# EasyEDA Pro project ProProject_基于CW32单片机的无刷电机控制器（旋转变压器位置反馈）_2024-06-02.epro, board PCB7
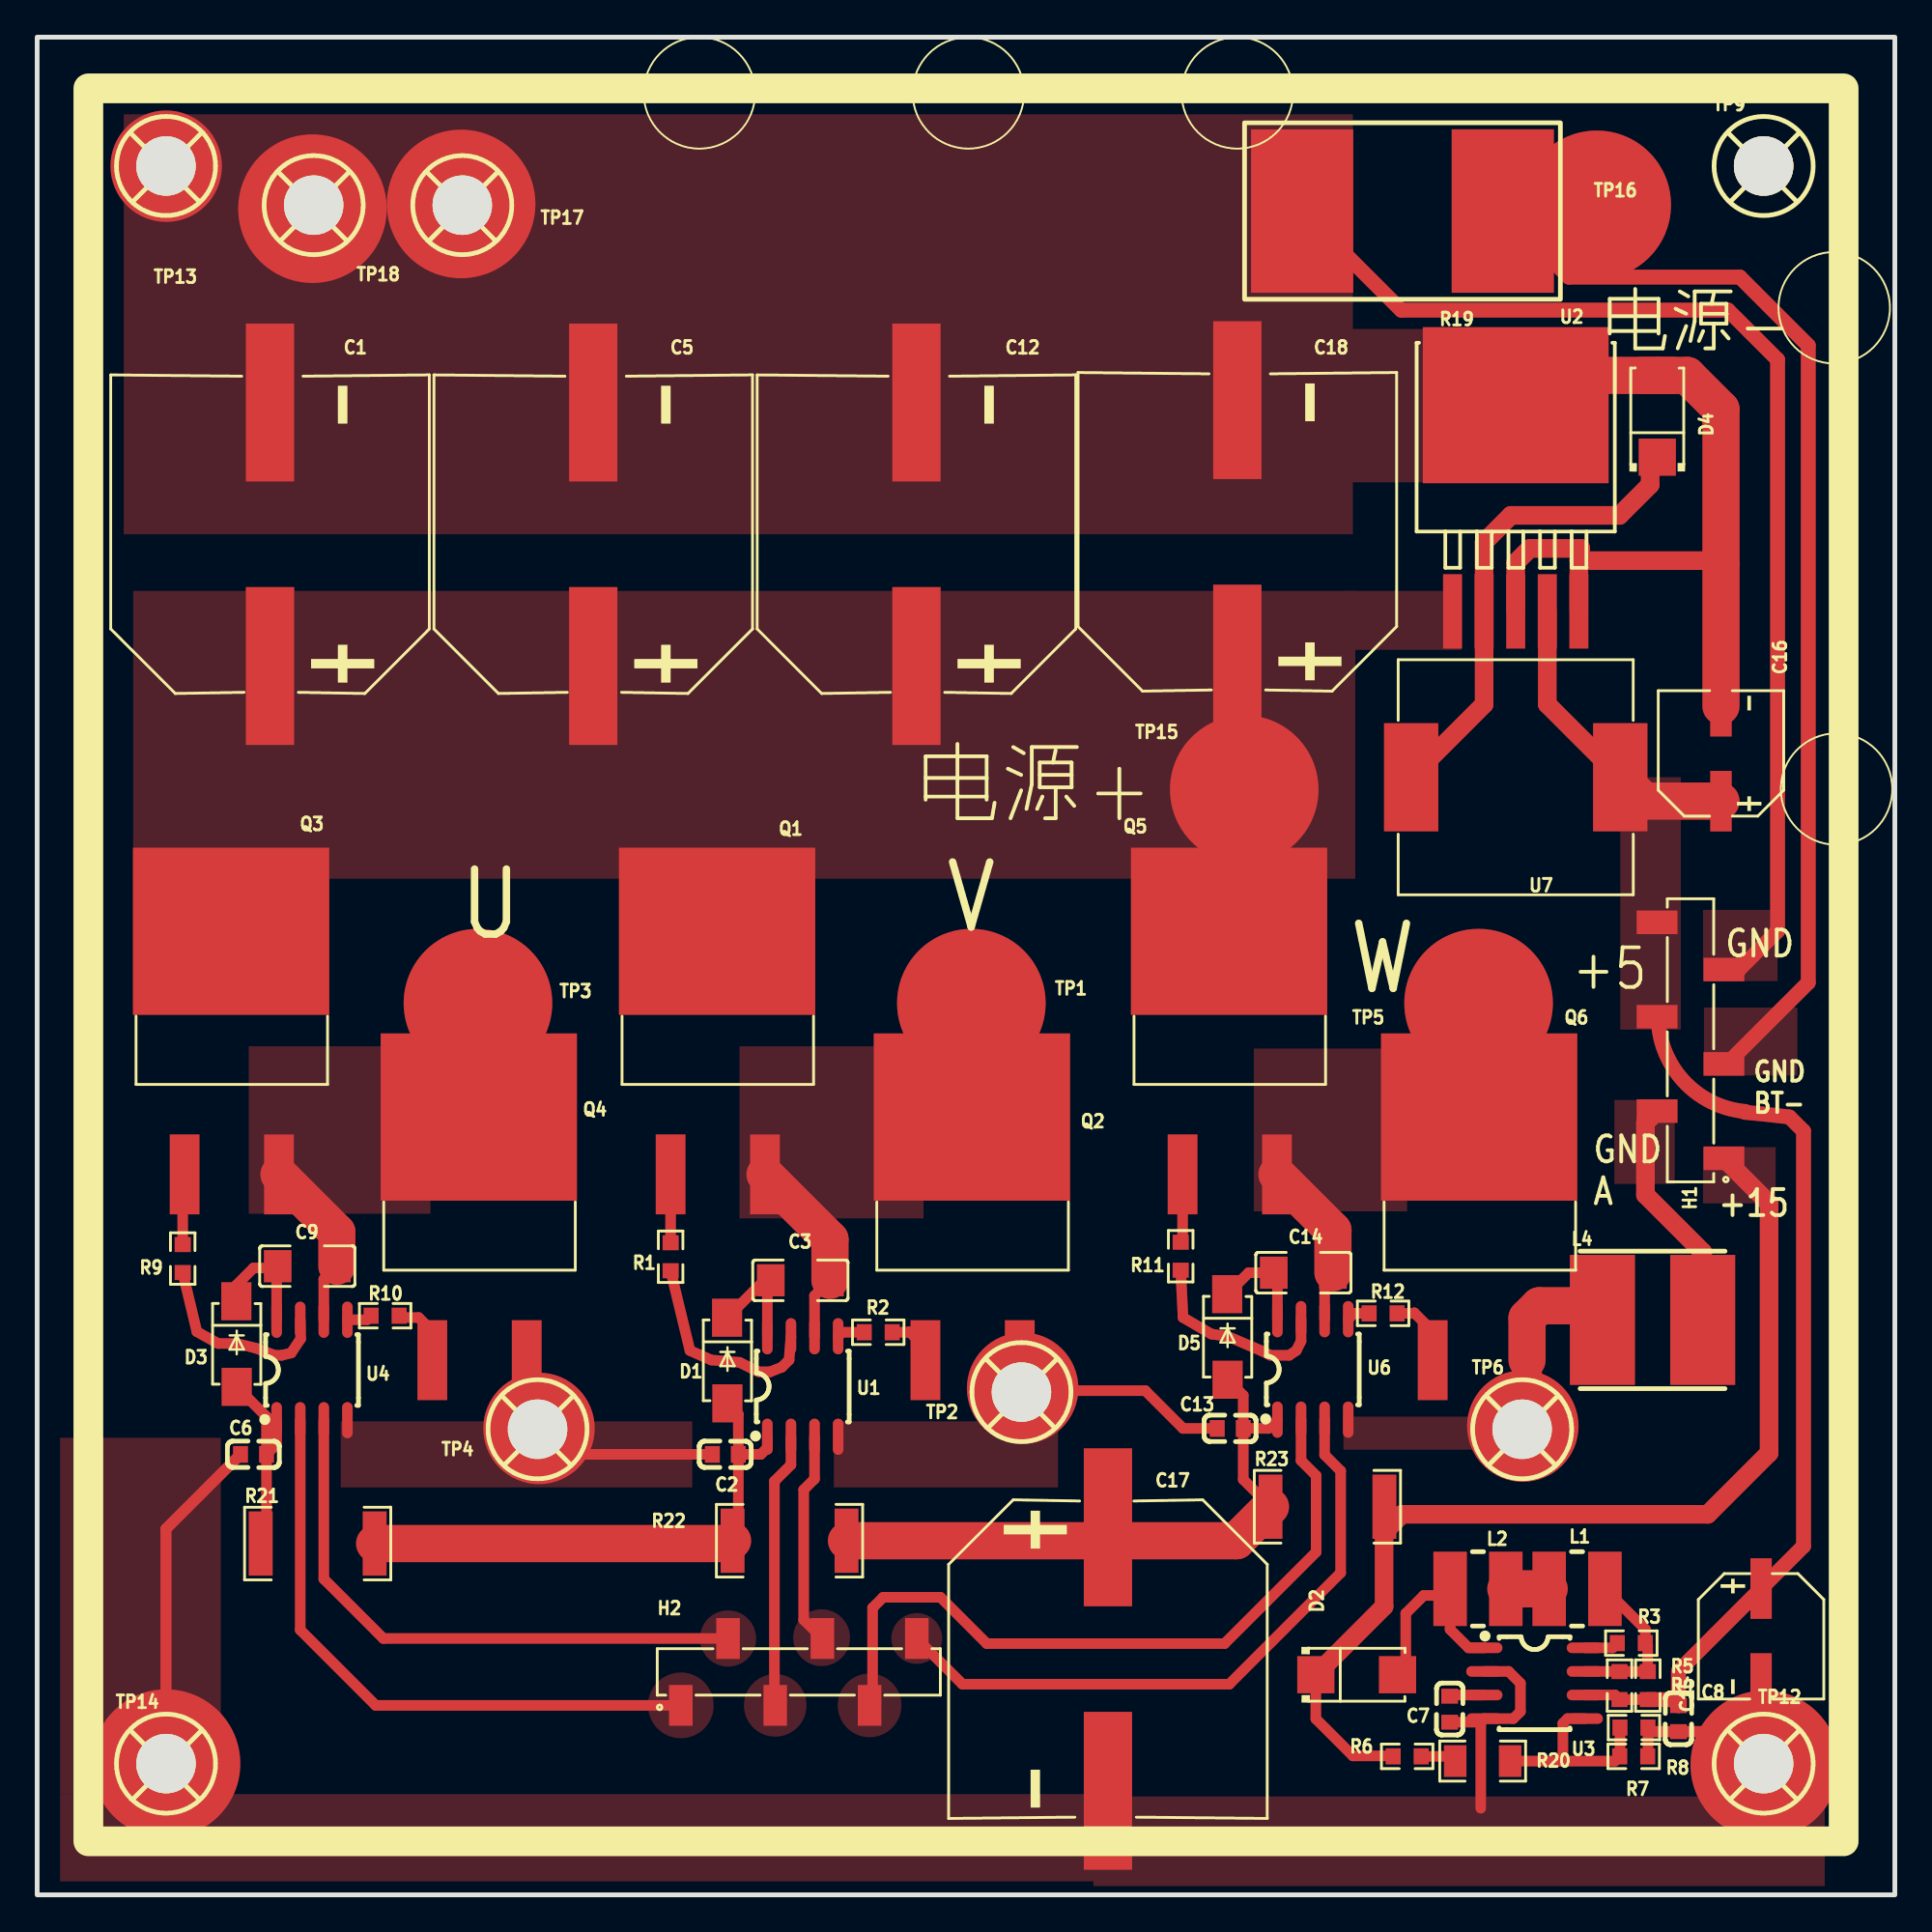
[diagram p6: board, top side]
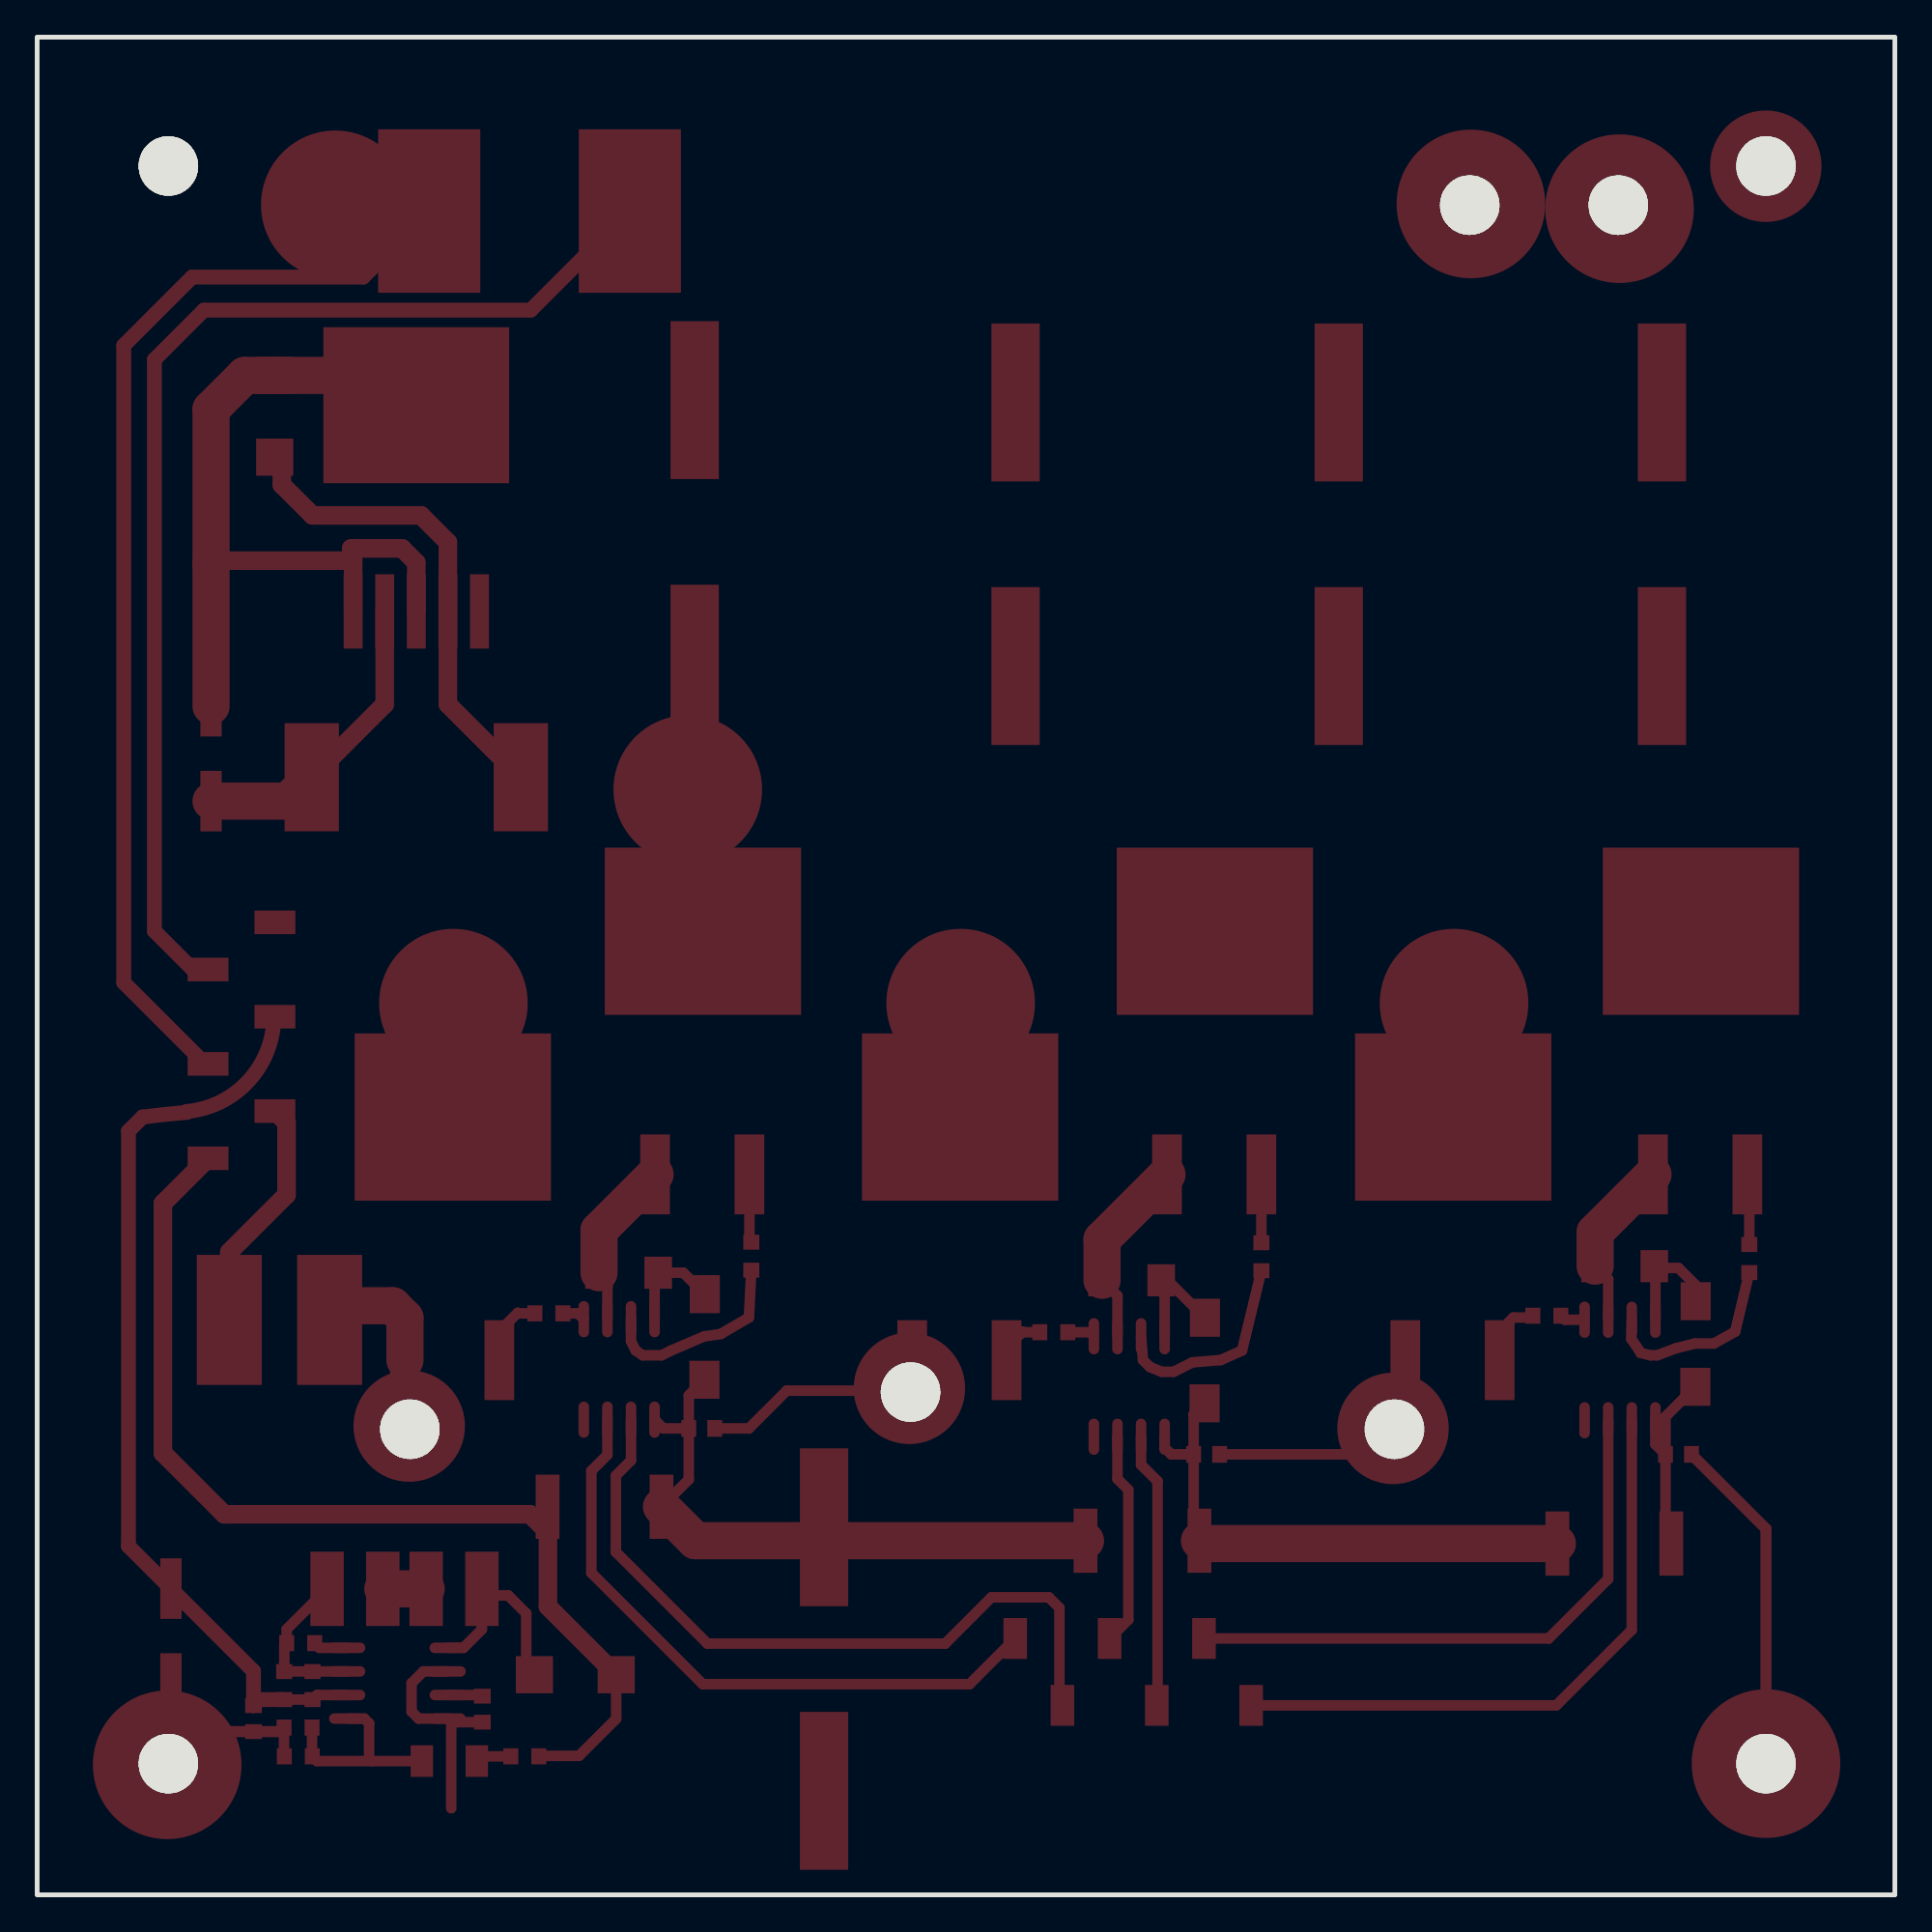
[diagram p7: board, bottom side, seen from below]

Outline 100 x 100 mm; copper layers: Top Layer, Bottom Layer. Coordinates in mm from the lower left corner of the outline.
Outline path: rectangle 0,0 100,100
Stack: Top Layer 0.035mm / Dielectric1 1.51mm FR4 er 4.5 / Bottom Layer 0.035mm

## Design rules (mm)
template: JLCPCB Capability(Two Layers Board)
spacing copperThickness1oz (default): track to track 0.102, other pairs 0.152 to 0.3
spacing copperThickness2oz: track to track 0.203, other pairs 0.152 to 0.3
track width copperThickness1oz (default): min 0.127, default 0.254, max 2.54
track width copperThickness2oz: min 0.203, default 0.254, max 2.54
differential pair differentialPair (default): width min 0.127, default 0.254, max 2.54; gap min 0.152, default 0.152
via viaSize (default): diameter min 0.5, default 0.61, max 10; hole min 0.3, default 0.305, max 6.3

## Placement (name value [footprint] x y rotation side)
C1  2200uF  [CAP-SMD_BD16.0-L17.0-W17.0-LS18.0-FD]  12.53 73.24 90 top
C2  100nF  [C0603]  37.05 23.71 0 top
C3  10uF  [C1206]  41.08 33.08 180 top
C5  2200uF  [CAP-SMD_BD16.0-L17.0-W17.0-LS18.0-FD]  29.93 73.24 90 top
C6  100nF  [C0603]  11.65 23.71 0 top
C7  1nF  [C0603]  76.03 10 270 top
C8  100nF  [C0603]  88.35 9.49 90 top
C9  10uF  [C1206]  14.54 33.84 180 top
C12  2200uF  [CAP-SMD_BD16.0-L17.0-W17.0-LS18.0-FD]  47.33 73.24 90 top
C13  100nF  [C0603]  64.22 25.11 0 top
C14  10uF  [C1206]  68.16 33.49 180 top
C15  220uF  [CAP-SMD_BD6.3-L6.6-W6.6-LS7.2-R-RD]  92.8 13.93 90 top
C16  220uF  [CAP-SMD_BD6.3-L6.6-W6.6-LS7.2-R-RD]  90.64 61.43 270 top
C17  2200uF  [CAP-SMD_BD16.0-L17.0-W17.0-LS18.0-FD]  57.64 12.69 270 top
C18  2200uF  [CAP-SMD_BD16.0-L17.0-W17.0-LS18.0-FD]  64.6 73.37 90 top
D1  RS1M  [SMA_L4.3-W2.6-LS5.0-FD]  37.15 28.76 90 top
D2  SS34  [SMA_L4.3-W2.6-LS5.2-RD]  71.03 11.85 0 top
D3  RS1M  [SMA_L4.3-W2.6-LS5.0-FD]  10.73 29.65 90 top
D4  SS34  [SMA_L4.3-W2.6-LS5.2-RD]  87.21 79.59 90 top
D5  RS1M  [SMA_L4.3-W2.6-LS5.0-FD]  64.07 30.03 90 top
H1  X6511WVS-06H-C60D48R2  [HDR-SMD_6P-P2.54-V-M-LS4.8_R2]  89 46 90 top
H2  X6511WVS-06H-C60D48R2  [HDR-SMD_6P-P2.54-V-M-LS4.8_R2]  41 12 0 top
L1  47uH  [IND-SMD_L4.5-W4.0_SLF0403]  82.89 16.47 180 top
L2  47uH  [IND-SMD_L4.5-W4.0_SLF0403]  77.56 16.47 180 top
L4  2.2mH  [IND-SMD_L7.8-W7.0-A]  86.96 30.95 0 top
NOREF  -  [Pad_e577]  6.94 7.06 0 top
NOREF#2  -  [Pad_e290]  14.82 90.77 0 top
NOREF#3  -  [Pad_e293]  79.97 25.24 0 top
NOREF#4  -  [Pad_e288]  6.95 93.05 0 top
NOREF#5  -  [Pad_e289]  22.82 91.02 0 top
NOREF#6  -  [Pad_e291]  27.01 25.11 0 top
NOREF#7  -  [Pad_e337]  93 7 0 top
NOREF#8  -  [Pad_e292]  53.05 27.27 0 top
Q1  IRF2804STRLPBF  [D2PAK_L10.0-W9.0-P2.54-LS15.0-BR]  36.64 45 270 top
Q2  IRF2804STRLPBF  [D2PAK_L10.0-W9.0-P2.54-LS15.0-BR]  50.36 35 270 top
Q3  IRF2804STRLPBF  [D2PAK_L10.0-W9.0-P2.54-LS15.0-BR]  10.48 45 270 top
Q4  IRF2804STRLPBF  [D2PAK_L10.0-W9.0-P2.54-LS15.0-BR]  23.81 35 270 top
Q5  IRF2804STRLPBF  [D2PAK_L10.0-W9.0-P2.54-LS15.0-BR]  64.2 45 270 top
Q6  IRF2804STRLPBF  [D2PAK_L10.0-W9.0-P2.54-LS15.0-BR]  77.66 35 270 top
R1  10Ω  [R0603]  34.1 34.35 90 top
R2  10Ω  [R0603]  45.28 30.29 0 top
R3  100Ω  [R0603]  85.81 13.55 0 top
R4  1Ω  [R0603]  85.18 11.26 90 top
R5  1Ω  [R0603]  86.7 11.26 90 top
R6  10kΩ  [R0603]  73.75 7.46 180 top
R7  10kΩ  [R0603]  85.94 7.46 180 top
R8  1kΩ  [R0603]  85.96 9 180 top
R9  10Ω  [R0603]  7.84 34.25 90 top
R10  10Ω  [R0603]  18.73 31.17 0 top
R11  10Ω  [R0603]  61.56 34.38 90 top
R12  10Ω  [R0603]  72.45 31.3 0 top
R19  3mΩ  [R5930]  73.5 90.64 180 top
R20  0Ω  [R1206]  77.81 7.2 180 top
R21  0Ω  [R2512]  15.1 18.91 0 top
R22  0Ω  [R2512]  40.5 19.06 0 top
R23  0Ω  [R2512]  69.46 20.89 0 top
TP1  -  [test-point-0.5mm]  50.29 48 0 top
TP2  -  [M3螺丝]  53.05 27 0 top
TP3  -  [test-point-0.5mm]  23.73 48 0 top
TP4  -  [M3螺丝]  27 25 0 top
TP5  -  [test-point-0.5mm]  77.59 48 0 top
TP6  -  [M3螺丝]  80 25 0 top
TP9  -  [M3螺丝]  93 93 0 top
TP12  -  [M3螺丝]  93 7 0 top
TP13  -  [M3螺丝]  7 93 0 top
TP14  -  [M3螺丝]  7 7 0 top
TP15  -  [test-point-0.5mm]  64.98 59.5 0 top
TP16  -  [test-point-0.5mm]  83.95 90.97 0 top
TP17  -  [M3螺丝]  22.95 90.89 0 top
TP18  -  [M3螺丝]  14.95 90.89 0 top
U1  EG2131  [SOIC-8_L5.0-W4.0-P1.27-LS6.0-BL]  41.21 27.36 0 top
U2  LM2596S-5.0-MS  [TO-263-5_L10.0-W8.4-P1.70-LS15.3-BR]  79.59 74.64 270 top
U3  MC34063  [SOIC-8_L5.0-W4.0-P1.27-LS6.0-BL]  80.61 11.39 270 top
U4  EG2131  [SOIC-8_L5.0-W4.0-P1.27-LS6.0-BL]  14.8 28.25 0 top
U6  EG2131  [SOIC-8_L5.0-W4.0-P1.27-LS6.0-BL]  68.67 28.28 0 top
U7  100uH  [IND-SMD_L13.5-W12.8]  79.59 60.16 180 top

## Footprints (pads in the part's own frame, mm; a bottom-side part is the same pattern mirrored in y, then rotated)
C0603
  rect 0.8x0.9 smd: 1(-0.7,0) 2(0.7,0)
C1206
  rect 1.485x1.728 smd: 1(-1.593,0) 2(1.593,0)
CAP-SMD_BD6.3-L6.6-W6.6-LS7.2-R-RD
  rect 3.26x1.15 smd: 1(2.555,0) 2(-2.555,0)
CAP-SMD_BD16.0-L17.0-W17.0-LS18.0-FD
  rect 8.5x2.6 smd: 1(-7.093,0) 2(7.093,0)
D2PAK_L10.0-W9.0-P2.54-LS15.0-BR
  rect 4.3x1.6 smd: 1(6.218,-2.54) 3(6.218,2.54)
  rect 9x10.566 smd: 2(-6.87,-0.038)
HDR-SMD_6P-P2.54-V-M-LS4.8_R2
  rect 1.27x2.2 smd: 1(-6.35,-1.8) 2(-3.81,1.8) 3(-1.27,-1.8) 4(1.27,1.8) 5(3.81,-1.8) 6(6.35,1.8)
IND-SMD_L4.5-W4.0_SLF0403
  rect 1.8x4 smd: 1(-1.5,0) 2(1.5,0)
IND-SMD_L7.8-W7.0-A
  rect 3.5x7 smd: 1(-2.7,0) 2(2.7,0)
IND-SMD_L13.5-W12.8
  rect 2.924x5.82 smd: 1(5.628,0) 2(-5.628,0)
M3螺丝
  round 3.2 hole 3.2: 1(-0.064,0.064)
Pad_e288
  round 6 smd: TP1(0,0)
Pad_e289
  round 8 smd: TP2(0,0)
Pad_e290
  round 8 smd: TP3(0,0)
Pad_e291
  round 6 smd: TP4(0,0)
Pad_e292
  round 6 smd: TP5(0,0)
Pad_e293
  round 6 smd: TP6(0,0)
Pad_e337
  round 8 smd: TP6(0,0)
Pad_e577
  round 8 smd: TP4(0,0)
R0603
  rect 0.806x0.864 smd: 1(-0.753,0) 2(0.753,0)
R1206
  rect 1.208x1.701 smd: 1(-1.479,0) 2(1.479,0)
R2512
  rect 1.282x3.456 smd: 1(-3.067,0) 2(3.067,0)
R5930
  rect 5.5x8.8 smd: 1(-5.4,0) 2(5.4,0)
SMA_L4.3-W2.6-LS5.0-FD
  rect 2.046x1.62 smd: 1(-2.304,-0.009) 2(2.304,0.009)
SMA_L4.3-W2.6-LS5.2-RD
  rect 2x2 smd: 1(-2.2,0) 2(2.2,0)
SOIC-8_L5.0-W4.0-P1.27-LS6.0-BL
  oval 0.569x1.95 smd: 1(-1.905,-2.705) 2(-0.635,-2.705) 3(0.635,-2.705) 4(1.905,-2.705) 5(1.905,2.705) 6(0.635,2.705) 7(-0.635,2.705) 8(-1.905,2.705)
test-point-0.5mm
  round 8 smd: 1(0,0)
TO-263-5_L10.0-W8.4-P1.70-LS15.3-BR
  rect 4x1.02 smd: 1(5.55,-3.4) 2(5.55,-1.7) 3(5.55,0) 4(5.55,1.7) 5(5.55,3.4)
  rect 8.4x10 smd: 6(-5.55,0)

## Nets
As in the schematic, except:
GND: C1.2 C2.1 C5.2 C6.1 C7.2 C8.1 C12.2 C13.1 C15.2 C16.2 C17.2 C18.2 D4.2 H1.5 L4.1 NOREF.TP4 NOREF#2.TP3 NOREF#3.TP6 NOREF#4.TP1 NOREF#5.TP2 NOREF#6.TP4 NOREF#7.TP6 NOREF#8.TP5 Q2.3 Q4.3 Q6.3 R7.1 R8.1 R19.2 TP2.1 TP4.1 TP6.1 TP9.1 TP12.1 TP13.1 TP14.1 TP17.1 TP18.1 U1.4 U2.3 U2.5 U2.6 U3.2 U3.4 U4.4 U6.4

## Routing (per net, layer and track width the routed paths; a pad name or vN(x,y) marks a point on that pad's centre or on a via; arc(x,y) is an arc through that point)
+5V: length 66.7
  Top Layer w0.568: R5.1 R4.1 84.93,10.76 U3.6
  Top Layer w0.8: R5.1 88.03,10.51 88.35,10.19 88.35,12.04 C15.1 95.09,18.77 95.09,41.11 94.32,41.87 arc(93.12,42.01) 91.91,42.13 ; 87.26,47.31 arc(88.61,43.82) 91.97,42.17
  Top Layer w1: U7.2 81.29,64.09 U2.4
  Top Layer w2: U7.2 86.5,58.88 C16.1
+15V: length 55.9
  Top Layer w0.568: D2.1 68.83,9.48 70.83,7.48 72.97,7.48 R6.2
  Top Layer w1: D2.1 72.5,15.52 72.5,19.52 73.47,20.49 89.93,20.49 93.23,23.79 93.23,37.22 H1.1
+15V1: length 34.4
  Top Layer w0.568: C13.2 64.92,26.88 D5.1 ; C13.2 66.29,25.11 U6.1 ; C13.2 64.92,22.36 R23.1
  Top Layer w2: 56.92,19.06 C17.1 ; 56.92,19.06 64.56,19.06 R23.1 ; 56.92,19.06 R22.2
+15V2: length 29.4
  Top Layer w0.568: C2.2 37.75,19.37 R22.1 ; C2.2 38.95,23.71 39.31,24.07 U1.1 ; C2.2 37.75,25.87 D1.1
  Top Layer w2: R22.1 37.28,18.91 18.17,18.91
GND: length 181.3
  Top Layer w0.568: 77.71,9.29 U3.4 79.46,9.49 79.84,9.87 79.84,11.39 79.21,12.03 U3.2 ; 77.71,9.29 C7.2 ; 77.71,9.29 77.71,4.66 ; R7.1 86.71,7.47 R8.1 ; C2.1 28.41,23.71 NOREF#6.TP4 ; NOREF#8.TP5 53.18,27.14 59.65,27.14 61.68,25.11 C13.1
  Top Layer w0.6: NOREF.TP4 6.94,19.7 C6.1 ; R8.1 86.93,8.79 C8.1 91.21,8.79 TP12.1
  Top Layer w0.8: TP12.1 92.94,11.24 C15.2 ; H1.5 91.62,49.81 93.69,51.88 93.69,82.64 91.02,85.31 73.43,85.31 R19.2
  Top Layer w1: 82.99,71.82 82.99,72.38 83.09,72.48 80.35,72.48 79.59,71.72 U2.3 ; 82.99,71.82 90.47,71.82 90.64,71.65 ; 82.99,71.82 U2.5
  Top Layer w2: Q6.3 80.2,31.05 80.86,31.71 83.5,31.71 L4.1 ; U2.6 81.19,81.79 D4.2 88.82,81.79 90.64,79.97 90.64,63.98
GND_A: length 12.8
  Top Layer w1: H1.2 86.58,41.57 86.58,37.68 89.66,34.6 L4.2
GND_BT-: length 60.1
  Top Layer w0.8: R19.1 82.45,87.08 91.66,87.08 95.34,83.4 95.34,49.11 90.96,44.73 H1.3
PA8_ATIM_CH1A_U_H: length 33.5
  Top Layer w0.568: H2.1 18.22,10.2 14.16,14.26 U4.2
PA9_ATIM_CH2A_V_H: length 14.8
  Top Layer w0.568: H2.3 39.69,10.24 39.69,22.26 40.58,23.15 U1.2
PA10_ATIM_CH3A_W_H: length 40
  Top Layer w0.568: H2.5 44.97,10.36 44.97,15.45 45.54,16.01 48.63,16.01 51.12,13.53 63.92,13.53 68.85,18.45 68.85,22.57 68.03,23.38 U6.2
PB13_ATIM_CH1B_U_L: length 31.6
  Top Layer w0.568: U4.3 15.43,17.01 18.64,13.8 H2.2
PB14_ATIM_CH2B_V_L: length 11.5
  Top Layer w0.568: U1.3 41.85,22.39 41.26,21.81 41.26,14.81 H2.4
PB15_ATIM_CH3B_W_L: length 34.9
  Top Layer w0.568: U6.3 69.3,23.69 70.17,22.82 70.17,17.34 64.17,11.34 49.81,11.34 H2.6
$2N841: length 1.5
  Top Layer w0.568: U1.5 43.33,30.29 R2.1
$2N1882: length 26.1
  Top Layer w1: U7.1 77.89,64.09 U2.2 77.89,72.81 79.34,74.26 85.18,74.26 86.83,75.91 86.83,77.01 87.21,77.39
$2N2223: length 1.9
  Top Layer w0.568: U3.8 84.81,13.3 R3.1
$2N2340: length 2.3
  Top Layer w2: L1.2 L2.1
$2N2437: length 1.9
  Top Layer w0.568: U3.3 76.1,10.76 C7.1
$2N2721: length 10.9
  Top Layer w0.568: 82.02,7.2 82.13,7.31 82.13,9.23 82.38,9.49 U3.5 ; 82.02,7.2 84.93,7.2 R7.2 85.2,7.47 R8.2 ; 82.02,7.2 R20.1
$2N2790: length 10.5
  Top Layer w0.568: U3.1 77.05,13.3 76.06,14.29 L2.2 ; 75.81,16.12 74.64,16.12 73.67,15.15 73.67,12.29 D2.2
$2N6462: length 3.8
  Top Layer w0.568: Q3.1 7.84,38.68 R9.2
$2N6470: length 1.4
  Top Layer w0.568: U4.5 17.76,30.96 R10.1
$2N6475: length 11.3
  Top Layer w0.568: C6.2 12.89,24.26 U4.1 ; C6.2 12.35,19.22 R21.1 ; C6.2 12.35,25.74 D3.1
$2N6902: length 3.9
  Top Layer w0.568: Q6.1 75.12,30.34 74.13,31.33 74.1,31.3 R12.2
$2N6903: length 3.7
  Top Layer w0.568: Q5.1 61.66,35.23 R11.2
$2N6911: length 1.3
  Top Layer w0.568: U6.5 70.89,31.3 R12.1
$2N7060: length 10.5
  Top Layer w0.568: U1.6 41.85,32.25 C3.1
  Top Layer w2: C3.1 42.68,35.28 Q1.3
$2N7066: length 9.4
  Top Layer w0.568: U4.6 15.43,33.14 C9.1
  Top Layer w2: Q3.3 16.13,35.67 C9.1
$2N10076: length 8.8
  Top Layer w0.568: 85.17,12.03 86.69,12.03 ; 85.17,12.03 U3.7 ; 85.17,12.03 R4.2 ; 86.69,12.03 R5.2 ; 86.69,12.03 86.69,13.42 R3.2 86.57,14.3 L1.1
$2N13152: length 10.6
  Top Layer w0.568: R9.1 8.6,30.31 9.74,29.68 10.76,29.68 11.77,29.43 12.79,29.04 13.17,29.04 13.68,29.17 14.19,29.93 U4.7
$2N13180: length 6.3
  Top Layer w0.568: U4.8 12.89,33.78 ; 12.89,33.78 C9.2 ; 12.89,33.78 12.85,33.74 11.65,33.74 10.72,32.82 D3.2
$2N13207: length 10.9
  Top Layer w0.568: R11.1 61.68,31.08 63.21,30.19 64.1,30.06 65.88,29.3 66.38,29.04 67.4,29.04 67.78,29.3 68.03,29.81 U6.7
$2N13222: length 5.6
  Top Layer w0.568: D5.2 65.22,33.49 C14.2 66.76,33.29 U6.8
$2N13249: length 11.5
  Top Layer w0.568: U1.7 40.47,28.79 40.09,28.41 39.46,28.16 38.82,28.16 37.81,28.66 36.28,28.79 35.14,29.3 R1.1
$2N13264: length 6.3
  Top Layer w0.568: U1.8 39.31,32.89 C3.2 39.15,33.08 D1.2
$2N15080: length 3.7
  Top Layer w0.568: R1.2 Q1.1
$2N15124: length 2.8
  Top Layer w0.568: Q2.1 47.82,29.45 46.95,30.31 46.92,30.29 R2.2
$2N15258: length 3.7
  Top Layer w0.568: R10.2 19.58,31.08 20.54,31.08 21.27,30.34 Q4.1
$2N15347: length 9.2
  Top Layer w0.568: C14.1 69.3,33.04 U6.6
  Top Layer w2: Q5.3 69.75,35.77 C14.1
$2N32860: length 1.9
  Top Layer w0.568: R20.2 76.08,7.46 R6.1

## Copper pours and planes (outline as drawn; the poured copper is in the pictures)
+5V on Top Layer: 85.22,60.16 88.48,60.16 88.48,46.57 85.22,46.57
+15V on Top Layer: 89.68,40.25 93.58,40.25 93.58,37.22 89.68,37.22
GND on Top Layer: 67.4,84.29 84.54,84.29 84.54,76.03 67.4,76.03
GND on Top Layer: 16.34,25.49 35.27,25.49 35.27,21.93 16.34,21.93
GND on Top Layer: 1.23,5.42 58.25,5.42 58.25,0.72 1.23,0.72
GND on Top Layer: 1.23,24.6 9.89,24.6 9.89,5.42 1.23,5.42
GND on Top Layer: 4.66,95.85 70.83,95.85 70.83,73.24 4.66,73.24
GND on Top Layer: 70.32,25.74 78.57,25.74 78.57,23.97 70.32,23.97
GND on Top Layer: 42.89,25.49 54.95,25.49 54.95,21.93 42.89,21.93
GND on Top Layer: 56.86,5.3 96.23,5.3 96.23,0.47 56.86,0.47
GND on Top Layer: 89.68,53.02 93.69,53.02 93.69,49.19 89.68,49.19
GND_A on Top Layer: 84.9,42.79 88.15,42.79 88.15,38.27 84.9,38.27
GND_BT- on Top Layer: 89.73,47.77 94.75,47.77 94.75,44.11 89.73,44.11
VCC on Top Layer: 5.17,70.19 70.96,70.19 70.96,54.7 5.17,54.7
VCC on Top Layer: 70.38,70.19 76.67,70.19 76.67,67.02 70.38,67.02
PA8_ATIM_CH1A_U_H on Top Layer: 32.88,11.97 36.42,11.97 36.42,8.43 32.88,8.43
PA9_ATIM_CH2A_V_H on Top Layer: 38.05,11.88 41.41,11.88 41.41,8.52 38.05,8.52
PA10_ATIM_CH3A_W_H on Top Layer: 43.1,11.91 46.52,11.91 46.52,8.49 43.1,8.49
PB13_ATIM_CH1B_U_L on Top Layer: 35.68,15.31 38.7,15.31 38.7,12.29 35.68,12.29
PB14_ATIM_CH2B_V_L on Top Layer: 40.7,15.37 43.75,15.37 43.75,12.32 40.7,12.32
PB15_ATIM_CH3B_W_L on Top Layer: 45.98,15.17 48.72,15.17 48.72,12.43 45.98,12.43
$2N7060 on Top Layer: 37.81,45.68 47.71,45.68 47.71,36.41 37.81,36.41
$2N7066 on Top Layer: 11.39,45.68 21.17,45.68 21.17,36.67 11.39,36.67
$2N15347 on Top Layer: 65.49,45.56 73.75,45.56 73.75,36.79 65.49,36.79

## Text on the board
Top Silkscreen Layer: GND / BT- | +15 | GND | GND / A | +5 | U | V | W | 电源- | 电源+
